# EAGLE design sata-hub (EAGLE 6.5.0)
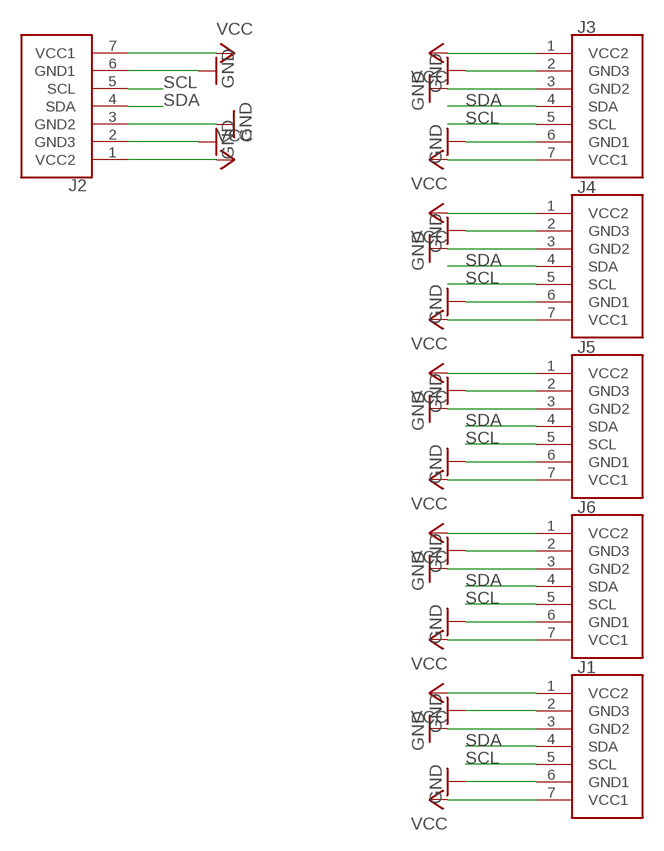
[diagram p0: schematic, sheet 1]

## Parts
J1  SATA7-RA  [SATA7-RA]
J2  SATA7-RA  [SATA7-RA]
J3  SATA7-RA  [SATA7-RA]
J4  SATA7-RA  [SATA7-RA]
J5  SATA7-RA  [SATA7-RA]
J6  SATA7-RA  [SATA7-RA]

## Nets
GND: J1.2(GND3) J1.3(GND2) J1.6(GND1) J2.2(GND3) J2.3(GND2) J2.6(GND1) J3.2(GND3) J3.3(GND2) J3.6(GND1) J4.2(GND3) J4.3(GND2) J4.6(GND1) J5.2(GND3) J5.3(GND2) J5.6(GND1) J6.2(GND3) J6.3(GND2) J6.6(GND1)
SCL: J1.5(SCL) J2.5(SCL) J3.5(SCL) J4.5(SCL) J5.5(SCL) J6.5(SCL)
SDA: J1.4(SDA) J2.4(SDA) J3.4(SDA) J4.4(SDA) J5.4(SDA) J6.4(SDA)
VCC: J1.1(VCC2) J1.7(VCC1) J2.1(VCC2) J2.7(VCC1) J3.1(VCC2) J3.7(VCC1) J4.1(VCC2) J4.7(VCC1) J5.1(VCC2) J5.7(VCC1) J6.1(VCC2) J6.7(VCC1)

## Library data of the parts
J1-J6 = dan-pc:SATA7: SATA 7-pin connector From host perspective, A is transmit and B is receive.

## Board
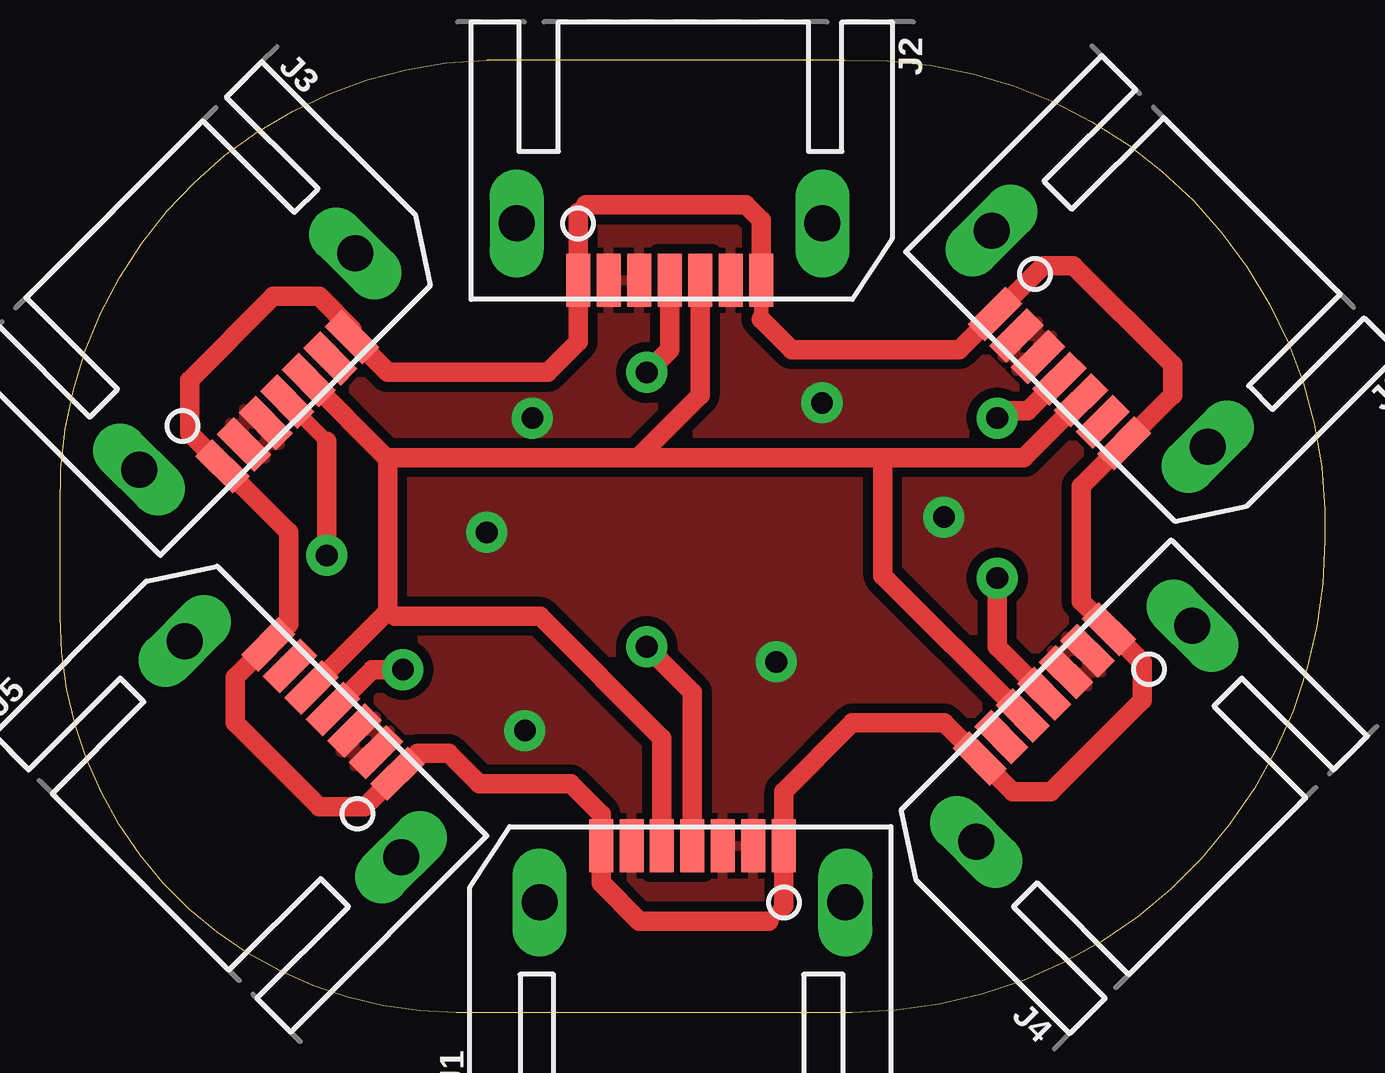
[diagram p1: board, top side]
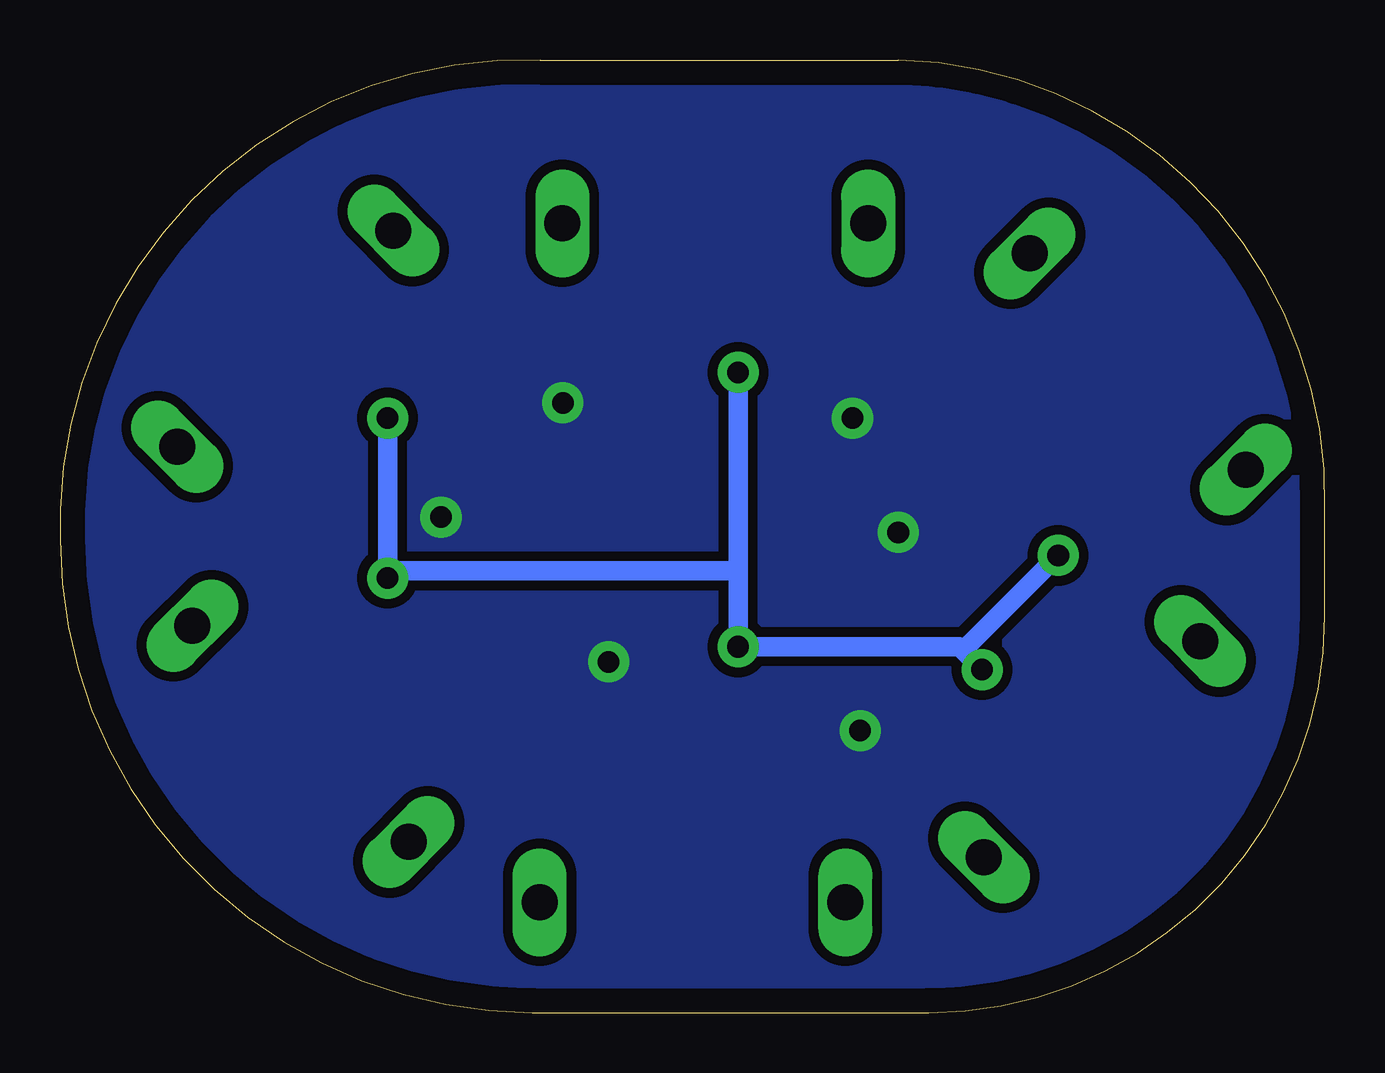
[diagram p2: board, bottom side, seen from below]

Size 52.71 x 39.69 mm. Coordinates in mm from the lower left corner, seen from the top.
Outline: 32.7,39.69 arc-90 52.71,20.96 52.71,19.68 arc-90 33.02,0 16.51,0 arc-90 0,16.51 0,20.96 arc-90 17.78,39.69 32.7,39.69
Copper layers (1*16): Top 0.035mm / dielectric 1.5mm / Bottom 0.035mm
Design rules "default *": minimum track width 10mil, minimum drill 24mil, track to track 8mil, track to pad 8mil, pad to pad 8mil, via to via 8mil, smd to smd 8mil, copper to edge 40mil, drill to drill 8mil, minimum pad ring 10mil, minimum via ring 8mil, stop-mask expansion 4mil, vias tented up to drill 0mil, thermal gap 10mil

### Footprints (pad centres in the part's own frame; a part is rotated, then mirrored left to right if it is on the bottom)
SATA7-RA = smd 2.2 x 1: 1 -4.41,3.81; 2 -4.41,2.54; 3 -4.41,1.27; 4 -4.41,0; 5 -4.41,-1.27; 6 -4.41,-2.54; 7 -4.41,-3.81 | drill 1.5 long: M1 -2.05,-6.37; M2 -2.05,6.37

### Placement (x,y rotation side)
J1  26.35,2.54 270 top
J2  25.4,34.92 90 top
J3  6.35,28.57 135 top
J4  44.13,10.16 315 top
J5  8.25,9.52 225 top
J6  44.77,29.53 45 top

### Tracks (layer width: path | path; a pad name or v marks a point on that pad's centre or on a via)
GND  (via drill 0.9)
  other vias: 19.68,24.76 31.75,25.4 29.84,14.61 19.37,11.75 36.83,20.64 17.78,20
  pour Top (isolate 0.406): -41.91,77.79 121.92,77.79 121.92,-40.32 -46.99,-40.32 -46.99,70.17
  pour Bottom (isolate 0.406): -77.79,60.01 96.84,60.01 96.84,-40.96 -90.81,-40.96 -90.81,36.83
N$1
  Top 0.61: 29.21,28.89 29.21,30.48
  Top 0.813: 38.73,28.89 37.47,27.62 30.48,27.62 29.21,28.89
SCL
  Top 0.61: 13.65,16.72 13.65,16.83 13.97,16.51 | 13.65,23.07 13.6,23.12
  Top 0.813: J5.5 13.65,16.72 | 13.65,16.83 13.65,23.07 | J3.5 13.6,23.12 24.08,23.12 | J1.5 25.08,11.43 20,16.51 13.97,16.51 | J2.5 26.67,25.72 24.08,23.12 | J6.5 40.16,23.12 34.29,23.12 | 34.29,23.12 24.08,23.12 | J4.5 34.29,18.21 34.29,23.12
SDA  (via drill 0.9)
  Top 0.61: J3.4 11.11,23.81 | v39.05,24.76 39.37,25.08
  Top 0.813: 11.11,23.81 v11.11,19.05 | v24.45,15.24 26.35,13.34 J1.4 | J5.4 13.02,14.29 v14.29,14.29 | v24.45,26.67 25.4,27.62 J2.4 | 39.37,25.08 40.32,25.08 J6.4 | J4.4 39.05,15.24 v39.05,18.1
  Bottom 0.61: 14.92,15.24 15.24,15.24 | v39.05,18.1 38.73,18.41
  Bottom 0.813: v11.11,19.05 14.92,15.24 | v14.29,14.29 15.24,15.24 v24.45,15.24 24.45,18.41 | 24.45,18.41 v24.45,26.67 | v39.05,18.1 v39.05,24.76 | 38.73,18.41 24.45,18.41
VCC
  Top 0.61: 12.16,28.16 J3.7 | 21.59,33.34 21.91,33.65 | 46.35,25.72 | 38.32,10.57 J4.7 | 30.16,4.44 29.53,3.81 | J5.7 9.52,16.18 | J5.1 14.91,10.79 | J4.1 43.71,15.98
  Top 0.813: 21.59,33.34 J2.1 21.59,27.94 20.32,26.67 13.65,26.67 12.16,28.16 12.16,28.48 10.8,29.85 8.89,29.85 5.4,26.35 5.4,24.14 J3.1 9.52,20.01 9.52,16.18 | 21.91,33.65 28.58,33.65 29.21,33.02 J2.7 | J6.1 40.97,31.11 42.23,31.11 46.35,26.99 46.35,25.72 | 46.35,25.72 J6.7 42.55,21.92 42.55,17.15 43.71,15.98 | J4.1 45.09,14.6 45.09,13.02 41.27,9.21 39.69,9.21 38.32,10.57 | 30.16,4.44 J1.1 30.16,9.21 33.02,12.06 36.84,12.06 J4.7 | 29.53,3.81 24.13,3.81 22.54,5.4 J1.7 22.54,8.25 21.27,9.52 17.46,9.52 16.19,10.79 14.91,10.79 | J5.1 12.69,8.57 10.8,8.57 7.3,12.06 7.3,13.97 J5.7